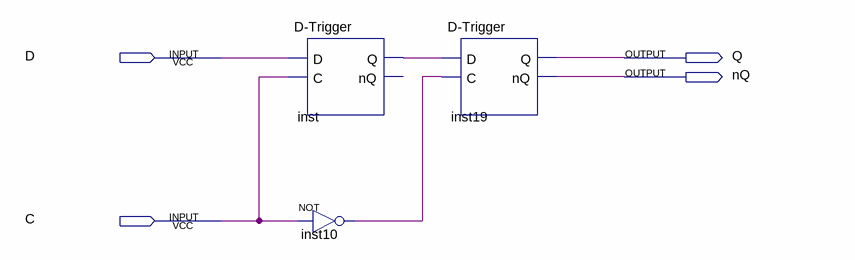
[diagram p0: schematic sheet]
// Quartus schematic D-TriggerWithRiseEdge.bdf as structural Verilog: 3 symbols, 4 pins
module \D-TriggerWithRiseEdge  (
  input  D,
  input  C,
  output Q,
  output nQ
);

  wire inst10_out, inst_q;

  \D-Trigger  inst (.D(D), .C(C), .Q(inst_q));  // open: nQ
  not inst10 (inst10_out, C);
  \D-Trigger  inst19 (.D(inst_q), .C(inst10_out), .Q(Q), .nQ(nQ));
endmodule
